# Altium schematic sheet RandomNumberGenerator.SchDoc
size A4
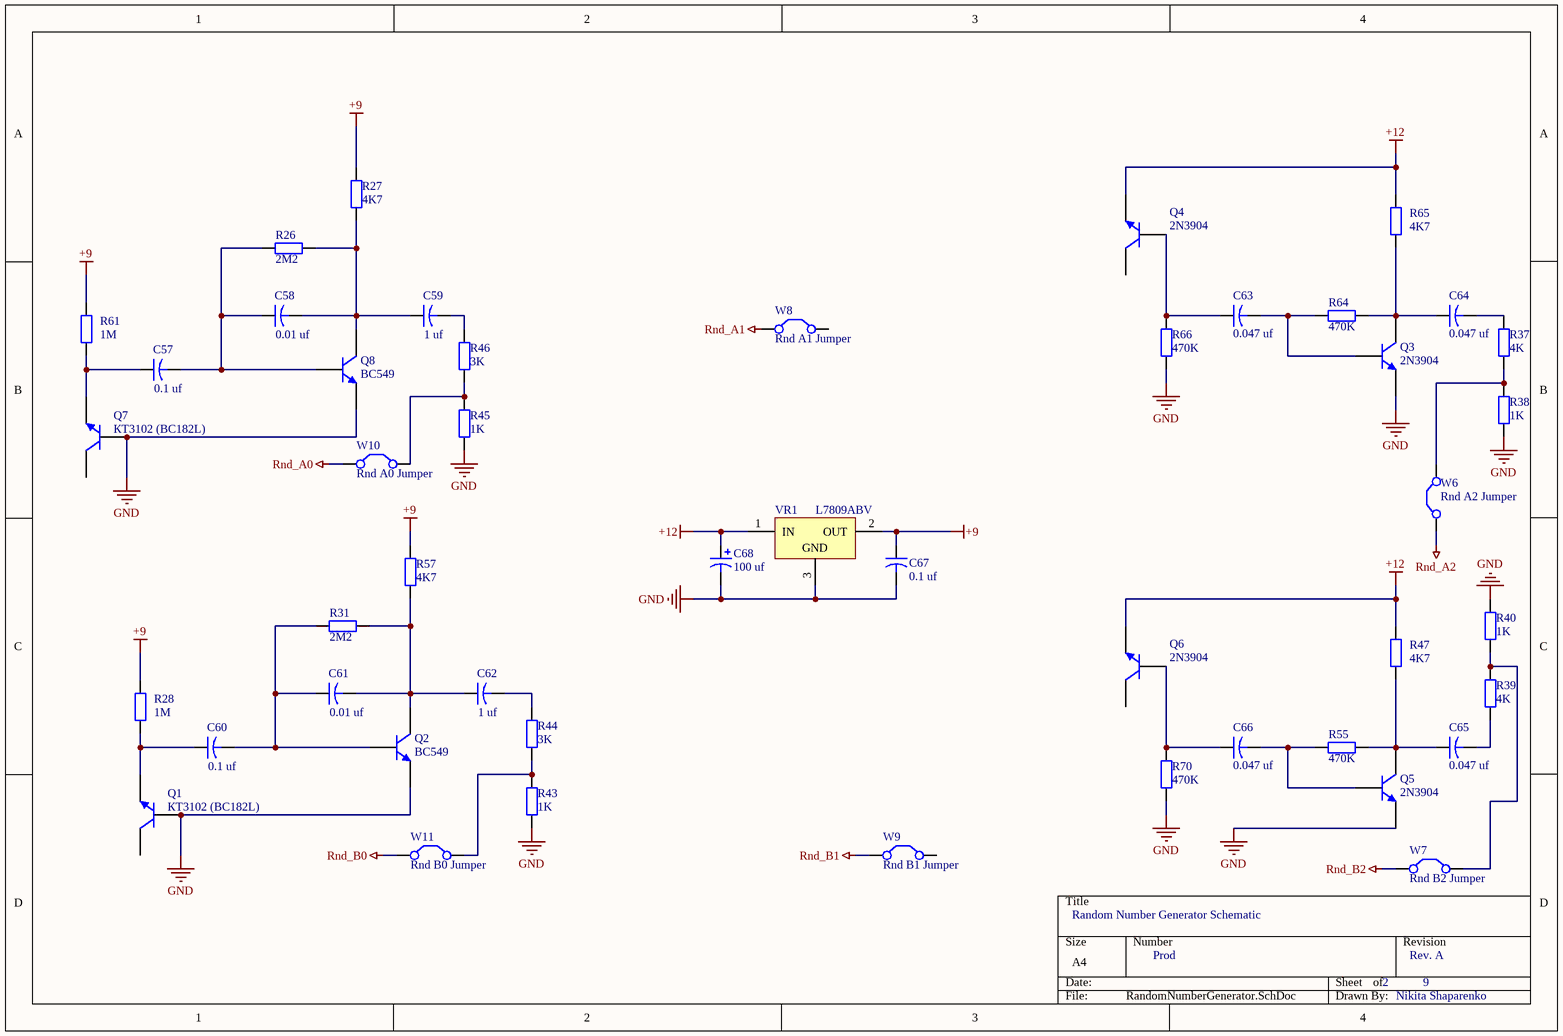
[diagram p0: RandomNumberGenerator.SchDoc]

## Parts
C57  value 0.1 uf  [CAPR5-4X5]  (hidden comment: Cap2)
C58  value 0.01 uf  [CAPR5-4X5]  (hidden comment: Cap2)
C59  value 1 uf  [CAPR5-4X5]  (hidden comment: Cap2)
C60  value 0.1 uf  [CAPR5-4X5]  (hidden comment: Cap2)
C61  value 0.01 uf  [CAPR5-4X5]  (hidden comment: Cap2)
C62  value 1 uf  [CAPR5-4X5]  (hidden comment: Cap2)
C63  value 0.047 uf  [CAPR5-4X5]  (hidden comment: Cap2)
C64  value 0.047 uf  [CAPR5-4X5]  (hidden comment: Cap2)
C65  value 0.047 uf  [CAPR5-4X5]  (hidden comment: Cap2)
C66  value 0.047 uf  [CAPR5-4X5]  (hidden comment: Cap2)
C67  value 0.1 uf  [CAPR5-4X5]  (hidden comment: Cap2)
C68  value 100 uf  [RAD-0.2]  (hidden comment: Cap Pol1)
Q1  КТ3102 (BC182L)  [TO-226-AA]
Q2  BC549  [TO-226-AA]
Q3  2N3904  [TO-226-AA]
Q4  2N3904  [TO-226-AA]
Q5  2N3904  [TO-226-AA]
Q6  2N3904  [TO-226-AA]
Q7  КТ3102 (BC182L)  [TO-226-AA]
Q8  BC549  [TO-226-AA]
R26  value 2M2  [AXIAL-0.4]  (hidden comment: Res2)
R27  value 4K7  [AXIAL-0.4]  (hidden comment: Res2)
R28  value 1M  [AXIAL-0.4]  (hidden comment: Res2)
R31  value 2M2  [AXIAL-0.4]  (hidden comment: Res2)
R37  value 4K  [AXIAL-0.4]  (hidden comment: Res2)
R38  value 1K  [AXIAL-0.4]  (hidden comment: Res2)
R39  value 4K  [AXIAL-0.4]  (hidden comment: Res2)
R40  value 1K  [AXIAL-0.4]  (hidden comment: Res2)
R43  value 1K  [AXIAL-0.4]  (hidden comment: Res2)
R44  value 3K  [AXIAL-0.4]  (hidden comment: Res2)
R45  value 1K  [AXIAL-0.4]  (hidden comment: Res2)
R46  value 3K  [AXIAL-0.4]  (hidden comment: Res2)
R47  value 4K7  [AXIAL-0.4]  (hidden comment: Res2)
R55  value 470K  [AXIAL-0.4]  (hidden comment: Res2)
R57  value 4K7  [AXIAL-0.4]  (hidden comment: Res2)
R61  value 1M  [AXIAL-0.4]  (hidden comment: Res2)
R64  value 470K  [AXIAL-0.4]  (hidden comment: Res2)
R65  value 4K7  [AXIAL-0.4]  (hidden comment: Res2)
R66  value 470K  [AXIAL-0.4]  (hidden comment: Res2)
R70  value 470K  [AXIAL-0.4]  (hidden comment: Res2)
VR1  L7809ABV  [TO220ABN]
W6  Rnd A2 Jumper  [RAD-0.2]
W7  Rnd B2 Jumper  [RAD-0.2]
W8  Rnd A1 Jumper  [RAD-0.2]
W9  Rnd B1 Jumper  [RAD-0.2]
W10  Rnd A0 Jumper  [RAD-0.2]
W11  Rnd B0 Jumper  [RAD-0.2]

## Nets
+9: C67.1 R27.2 R28.2 R57.2 R61.2 VR1.2(OUT)
+12: C68.1 Q4.3(E) Q6.3(E) R47.2 R65.2 VR1.1(IN)
GND: C67.2 C68.2 Q1.2(B) Q2.3(E) Q3.3(E) Q5.3(E) Q7.2(B) Q8.3(E) R38.1 R40.1 R43.1 R45.1 R66.1 R70.1 VR1.3(GND)
Rnd_A0: W10.1(C1)
Rnd_A1: W8.1(C1)
Rnd_A2: W6.1(C1)
Rnd_B0: W11.1(C1)
Rnd_B1: W9.1(C1)
Rnd_B2: W7.1(C1)
NetC57_1: C57.1 Q7.3(E) R61.1
NetC57_2: C57.2 C58.1 Q8.2(B) R26.2
NetC58_2: C58.2 C59.1 Q8.1(C) R26.1 R27.1
NetC59_2: C59.2 R46.2
NetC60_1: C60.1 Q1.3(E) R28.1
NetC60_2: C60.2 C61.1 Q2.2(B) R31.2
NetC61_2: C61.2 C62.1 Q2.1(C) R31.1 R57.1
NetC62_2: C62.2 R44.2
NetC63_1: C63.1 Q4.2(B) R66.2
NetC63_2: C63.2 Q3.2(B) R64.2
NetC64_1: C64.1 Q3.1(C) R64.1 R65.1
NetC64_2: C64.2 R37.2
NetC65_1: C65.1 Q5.1(C) R47.1 R55.1
NetC65_2: C65.2 R39.2
NetC66_1: C66.1 Q6.2(B) R70.2
NetC66_2: C66.2 Q5.2(B) R55.2
NetR37_1: R37.1 R38.2 W6.2(C2)
NetR39_1: R39.1 R40.2 W7.2(C2)
NetR43_2: R43.2 R44.1 W11.2(C2)
NetR45_2: R45.2 R46.1 W10.2(C2)

Not connected (* = marked no-connect by the designer): Q1 1(C); Q4 1(C); Q6 1(C); Q7 1(C); W8 2(C2); W9 2(C2)

## Notes on the sheet
- Random Number Generator Schematic
- Prod
- 2
- Rev. A
- 9
- Nikita Shaparenko

## Library data of the parts
C57-C67 = Cap2: Capacitor; Published: 23-Sep-2002; PackageReference: CAPR5-4X5; Publisher: Altium Limited; PackageDescription: Capacitor; 2 Leads
C68 = Cap Pol1: Polarized Capacitor (Radial); Published: 8-Jun-2000; LatestRevisionDate: 17-Jul-2002; LatestRevisionNote: Re-released for DXP Platform.; PackageReference: RB7.6-15; Publisher: Altium Limited; PackageDescription: Polarized Capacitor (Radial); 2 Leads
Q1-Q8 = NPN: NPN Bipolar Transistor; Published: 8-Jun-2000; LatestRevisionDate: 17-Jul-2002; LatestRevisionNote: Re-released for DXP Platform.; PackageReference: TO-226-AA; Publisher: Altium Limited; PackageDescription: TO, Flat Index; 3 In-Line, Axial Leads; Body Dia. 4.8mm; Leads 0.55 x 0.51 mm (max); Code_JEDEC: TO-226-AA
R26-R28 R31 R37-R40 R43-R47 R55 R57 R61 R64-R66 R70 = Res2: Resistor; Published: 8-Jun-2000; LatestRevisionDate: 17-Jul-2002; LatestRevisionNote: Re-released for DXP Platform.; PackageReference: AXIAL-0.4; Publisher: Altium Limited; PackageDescription: Axial Device, Thru-Hole; 2 Leads; 0.4 in Pin Spacing
VR1 = L7809ABV: Precision 1A Regulator; Published: 24-Aug-2001; LatestRevisionDate: 17-Jul-2002; LatestRevisionNote: Re-released for DXP Platform.; DatasheetVersion: Nov-1999; PackageVersion: Jun-1998; PackageReference: TO220ABN; Publisher: Altium Limited; PackageDescription: TO, Thru-Hole, Vertical, Heatsink Mounted; 3 In-Line Leads; Pitch 2.54 mm; Pin sequence 1, 3, 2; ComponentLink1Description: Manufacturer Link; ComponentLink1URL: http://www.st.com/; ComponentLink2Description: Datasheet; ComponentLink2URL: http://www.st.com/stonline/products/literature/ds/2144/l7805ab.pdf
W6-W11 = Jumper: Jumper Wire; Published: 24-Mar-1999; LatestRevisionDate: 17-Jul-2002; LatestRevisionNote: Re-released for DXP Platform.; PackageReference: RAD-0.2; Publisher: Altium Limited; PackageDescription: Radial Cap, Thru-Hole; 2 Leads; 0.2 in Pin Spacing